# Altium schematic sheet SchemaMateriel.SchDoc
size A3
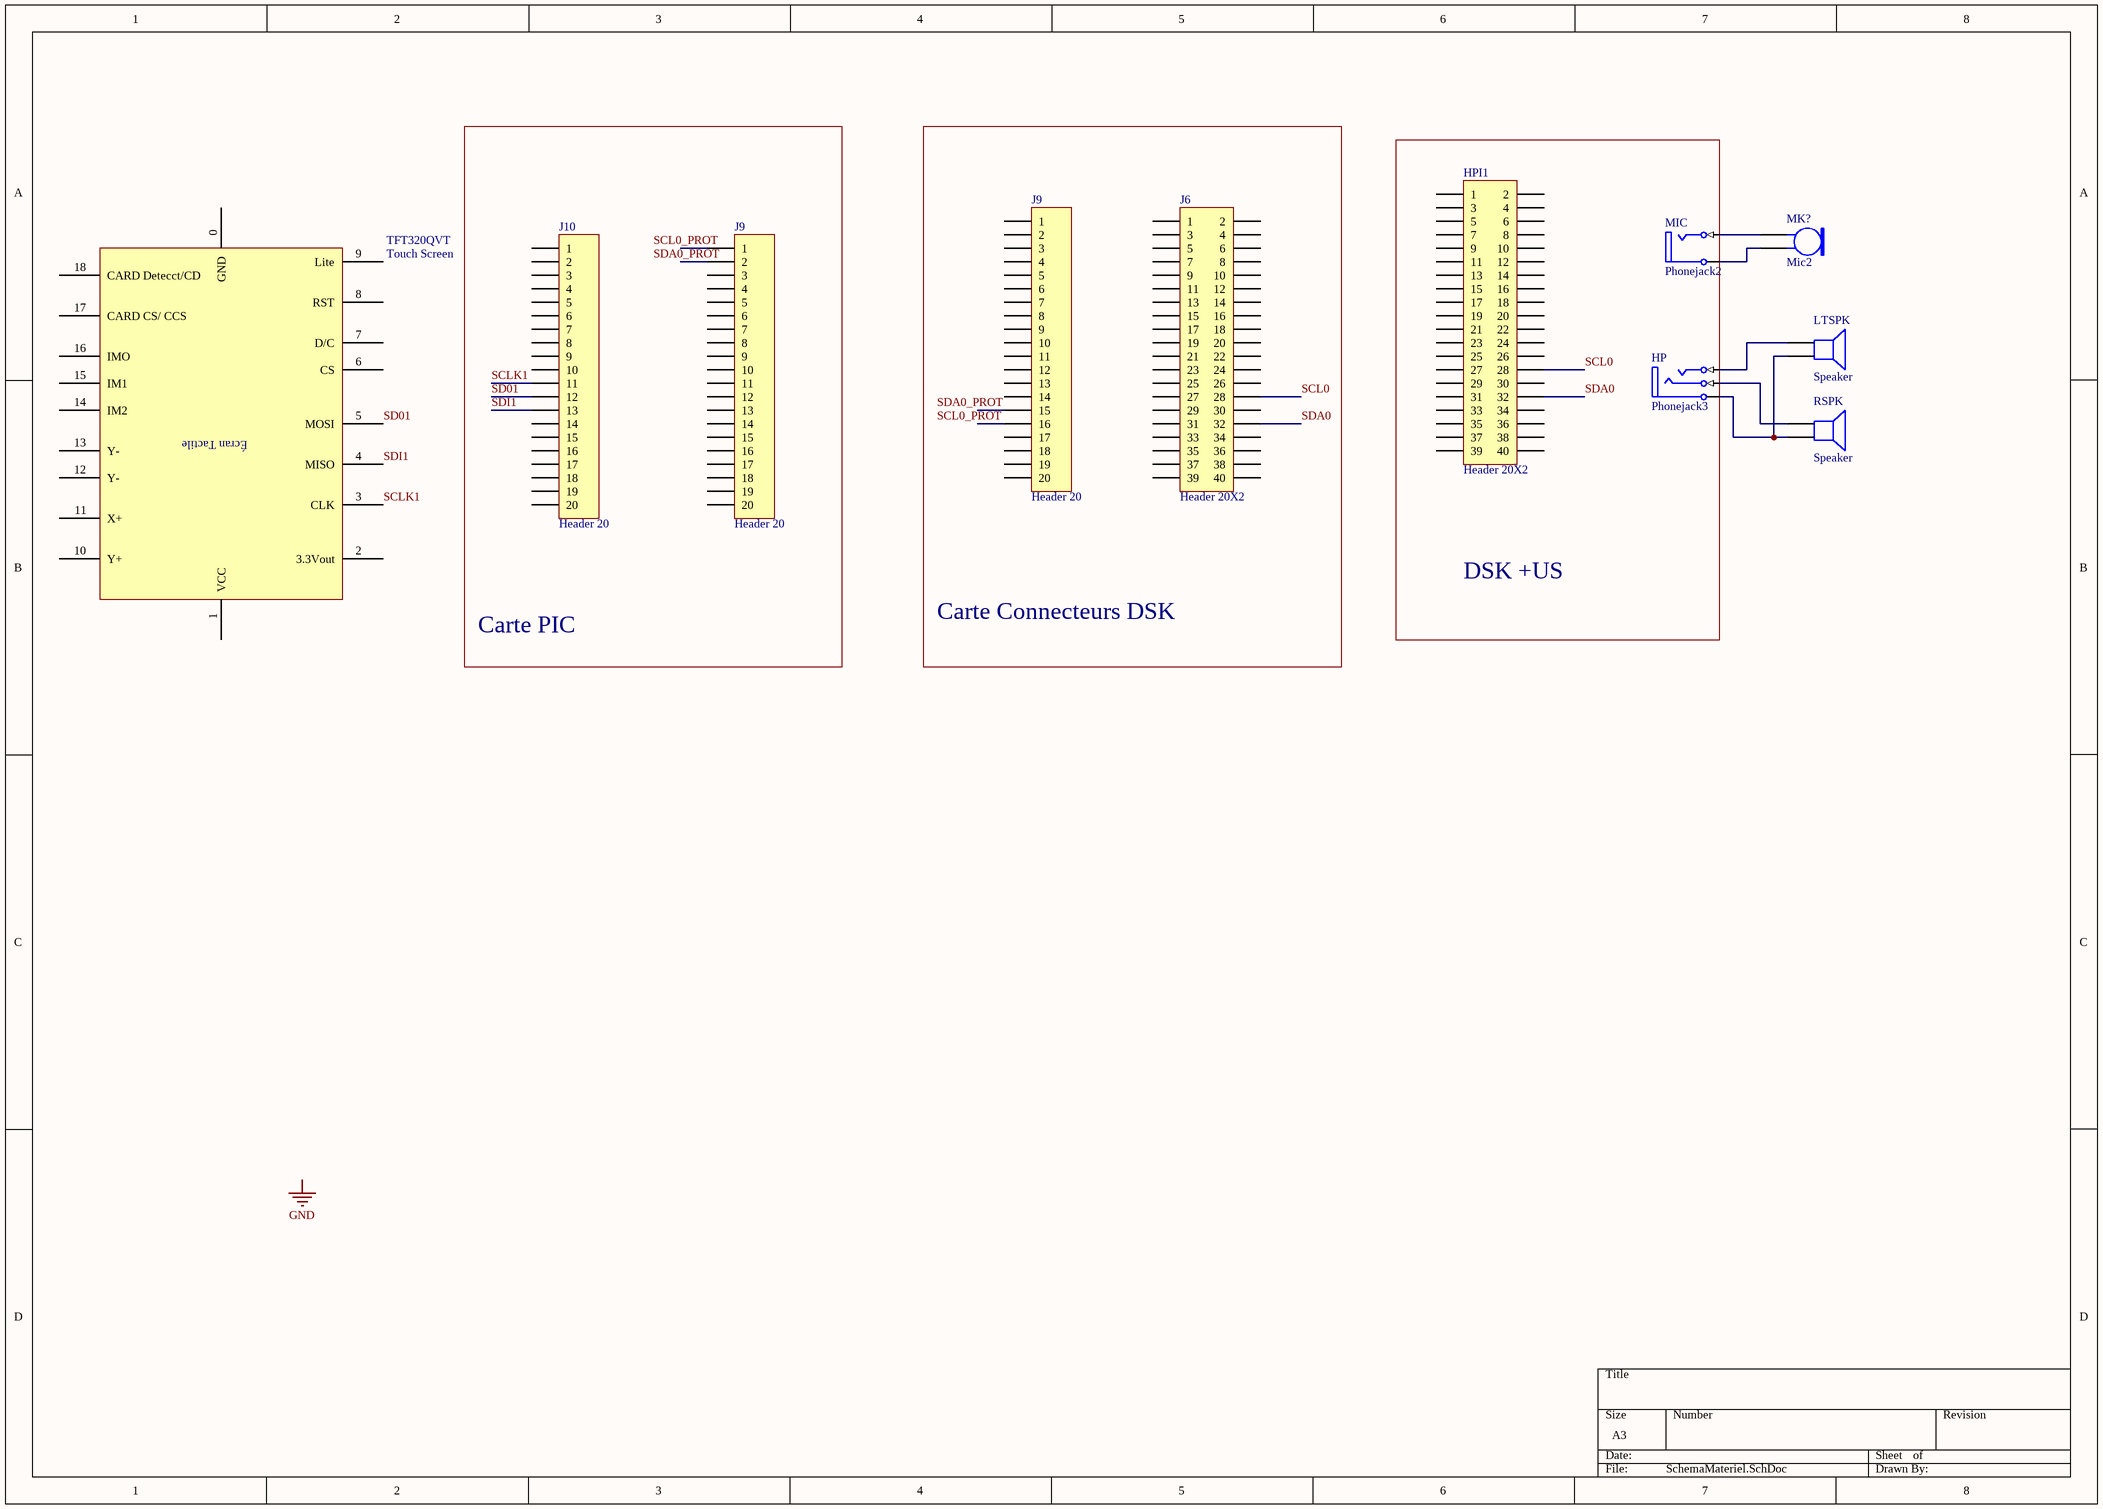
[diagram p0: SchemaMateriel.SchDoc]

## Parts
(Parts that share a designator on the sheet are numbered #1, #2 ... from top to bottom, then left to right.)
HP  Phonejack3  [JACK/6-V3]
HPI1  Header 20X2  [HDR2X20]
J6  Header 20X2  [HDR2X20]
J9#1  Header 20  [HDR1X20]
J9#2  Header 20  [HDR1X20]
J10  Header 20  [HDR1X20]
LTSPK  Speaker  [PIN2]
MIC  Phonejack2  [JACK/6-V2]
MK?  Mic2  [PIN2]
RSPK  Speaker  [PIN2]
TFT320QVT  Touch Screen

## Blocks framed on the sheet
Carte PIC: J9#2 J10
Carte Connecteurs DSK: J6 J9#1
DSK +US: HP HPI1 MIC

## Nets
SCL0: HPI1.28 J6.28
SCLK1: J10.11 TFT320QVT.3(CLK)
SD01: J10.12 TFT320QVT.5(MOSI)
SDA0: HPI1.32 J6.32
SDI1: J10.13 TFT320QVT.4(MISO)
NetHP_1: HP.1(T) LTSPK.1
NetHP_3: HP.3(R) RSPK.1
NetHP_5: HP.5(S) LTSPK.2 RSPK.2
NetMIC_1: MIC.1(T) MK?.1
NetMIC_5: MIC.5(S) MK?.2

Not connected (* = marked no-connect by the designer): HPI1 1 2 3 4 5 6 7 8 9 10 11 12 13 14 15 16 17 18 19 20 21 22 23 24 25 26 27 29 30 31 33 34 35 36 37 38 39 40; J6 1 2 3 4 5 6 7 8 9 10 11 12 13 14 15 16 17 18 19 20 21 22 23 24 25 26 27 29 30 31 33 34 35 36 37 38 39 40; J9#1 1 2 3 4 5 6 7 8 9 10 11 12 13 14 15 16 17 18 19 20; J9#2 1 2 3 4 5 6 7 8 9 10 11 12 13 14 15 16 17 18 19 20; J10 1 2 3 4 5 6 7 8 9 10 14 15 16 17 18 19 20; TFT320QVT 0(GND) 1(VCC) 2(3.3Vout) 6(CS) 7(D/C) 8(RST) 9(Lite) 10(Y+) 11(X+) 12(Y-) 13(Y-) 14(IM2) 15(IM1) 16(IMO) 17(CARD_CS/_CCS) 18(CARD_Detecct/CD)

## Notes on the sheet
- Labels drawn without touching a wire or pin: GND, SCL0_PROT, SDA0_PROT
- (in symbol Touch Screen) Écran Tactile

## Library data of the parts
HP = Phonejack3: Jack Socket, 1/4" [6.5mm], Thru-Hole, Vertical, 3-Conductor Open Circuit (Non-Normalling); PackageDocument: 2003; PCB_Layout: Complies with manufacturer's recommendation.; DrillAndSlotSize: Corresponds to nominal value.; Published: 15-Jul-2004; LatestRevisionDate: 15-Jul-2004; LatestRevisionNote: Component Replaced.; DatasheetDocument: 2003; PackageReference: S1VS_SSS; Publisher: Altium Limited; ComponentLink1Description: Manufacturer Link; ComponentLink1URL: http://www.cliffuk.co.uk/
HPI1 J6 = Header 20X2: Header, 20-Pin, Dual row; LatestRevisionDate: 17-Jul-2002; LatestRevisionNote: Re-released for DXP Platform.; Publisher: Altium Limited
J9#1 J9#2 J10 = Header 20: Header, 20-Pin; LatestRevisionDate: 17-Jul-2002; LatestRevisionNote: Re-released for DXP Platform.; Publisher: Altium Limited
LTSPK RSPK = Speaker: Loudspeaker; Published: 24-Mar-1999; LatestRevisionDate: 17-Jul-2002; LatestRevisionNote: Re-released for DXP Platform.; PackageReference: PIN2; Publisher: Altium Limited
MIC = Phonejack2: Jack Socket, 1/4" [6.5mm], Thru-Hole, Vertical, 2-Conductor Open Circuit; PackageDocument: 2003; PCB_Layout: Complies with manufacturer's recommendation.; DrillAndSlotSize: Corresponds to nominal value.; LatestRevisionDate: 15-Jul-2004; LatestRevisionNote: Component Replaced.; DatasheetDocument: 2003; PackageReference: S1VS_SNS; Publisher: Altium Limited; ComponentLink1Description: Manufacturer Link; ComponentLink1URL: http://www.cliffuk.co.uk/
MK? = Mic2: Microphone; Published: 24-Mar-1999; LatestRevisionDate: 17-Jul-2002; LatestRevisionNote: Re-released for DXP Platform.; PackageReference: PIN2; Publisher: Altium Limited